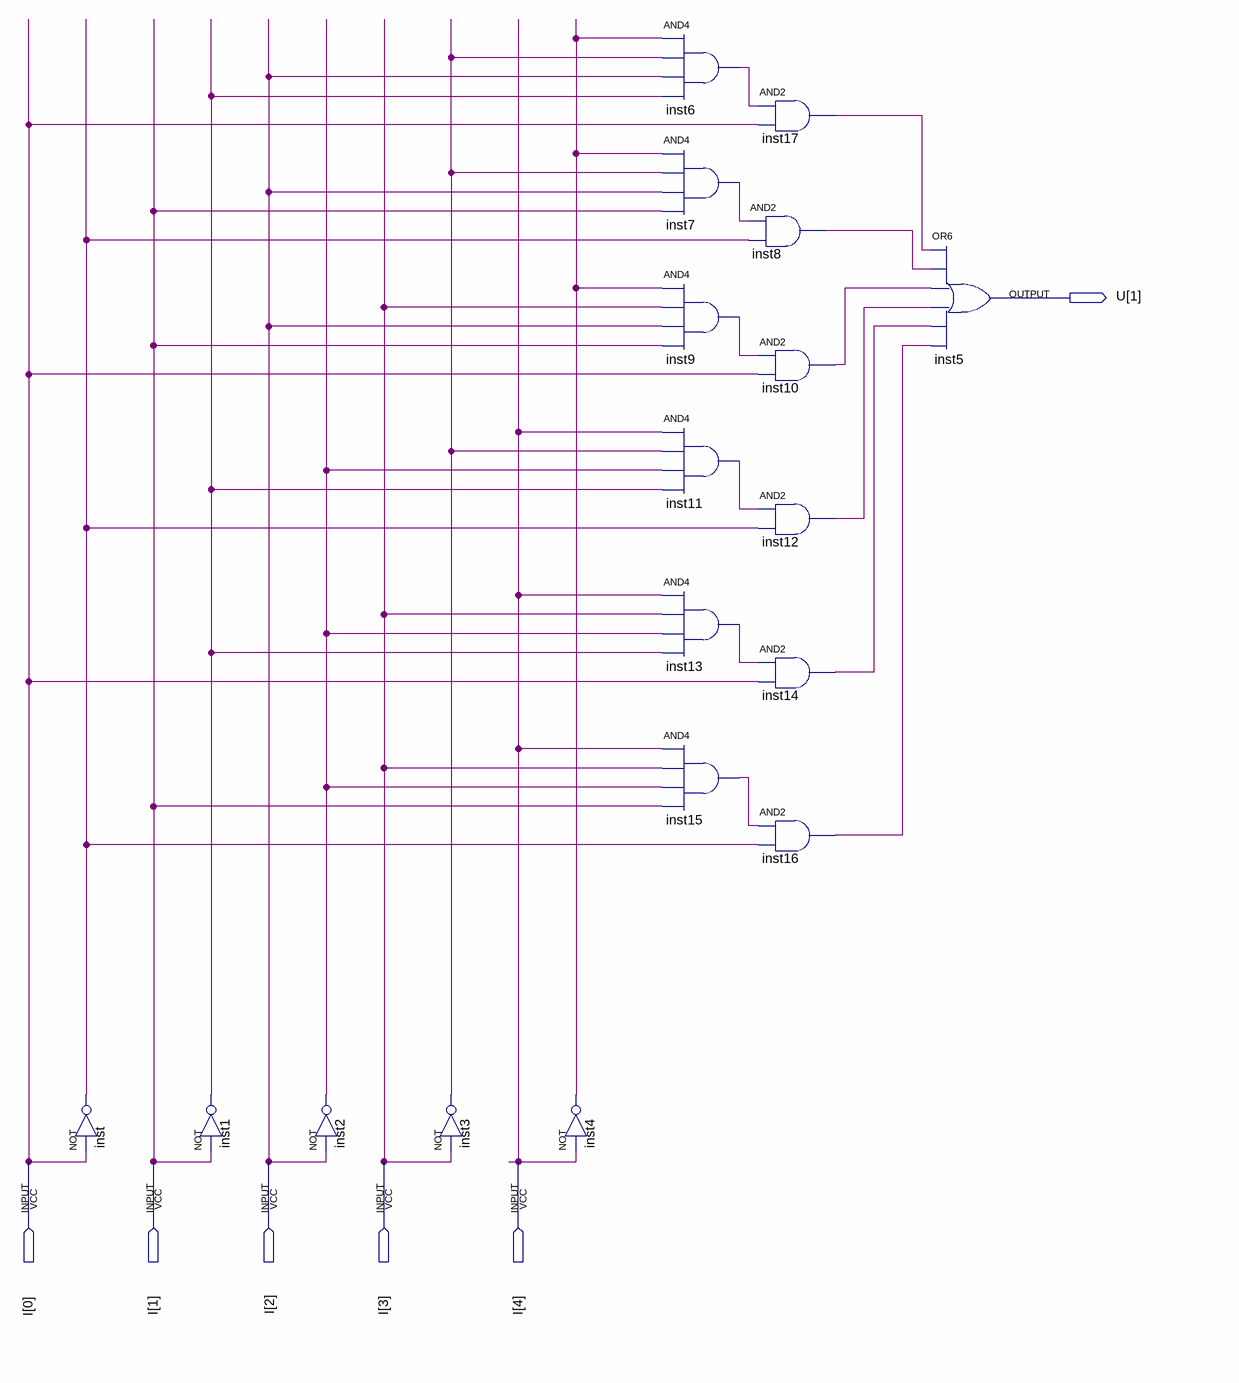
[diagram p0: schematic sheet]
// Quartus schematic BCD_b_Segment.bdf as structural Verilog: 18 symbols, 6 pins
module BCD_b_Segment (
  input  [4:0] I,
  output [1:1] U
);

  wire inst1_out, inst2_out, inst3_out, inst4_out, inst6_out, inst7_out, inst8_out, inst9_out, inst10_out,
       inst11_out, inst12_out, inst13_out, inst14_out, inst15_out, inst16_out, inst17_out, inst_out;

  not inst (inst_out, I[0]);
  not inst1 (inst1_out, I[1]);
  not inst2 (inst2_out, I[2]);
  not inst3 (inst3_out, I[3]);
  not inst4 (inst4_out, I[4]);
  and inst6 (inst6_out, inst4_out, inst3_out, I[2], inst1_out);
  and inst7 (inst7_out, inst4_out, inst3_out, I[2], I[1]);
  and inst9 (inst9_out, inst4_out, I[3], I[2], I[1]);
  and inst11 (inst11_out, I[4], inst3_out, inst2_out, inst1_out);
  and inst13 (inst13_out, I[4], I[3], inst2_out, inst1_out);
  and inst15 (inst15_out, I[4], I[3], inst2_out, I[1]);
  and inst17 (inst17_out, inst6_out, I[0]);
  and inst8 (inst8_out, inst7_out, inst_out);
  and inst10 (inst10_out, inst9_out, I[0]);
  and inst12 (inst12_out, inst11_out, inst_out);
  and inst14 (inst14_out, inst13_out, I[0]);
  and inst16 (inst16_out, inst15_out, inst_out);
  or inst5 (U[1], inst17_out, inst8_out, inst10_out, inst12_out, inst14_out, inst16_out);
endmodule
